# EAGLE design TMPZ84_minimum_BASIC (EAGLE 7.1.0)
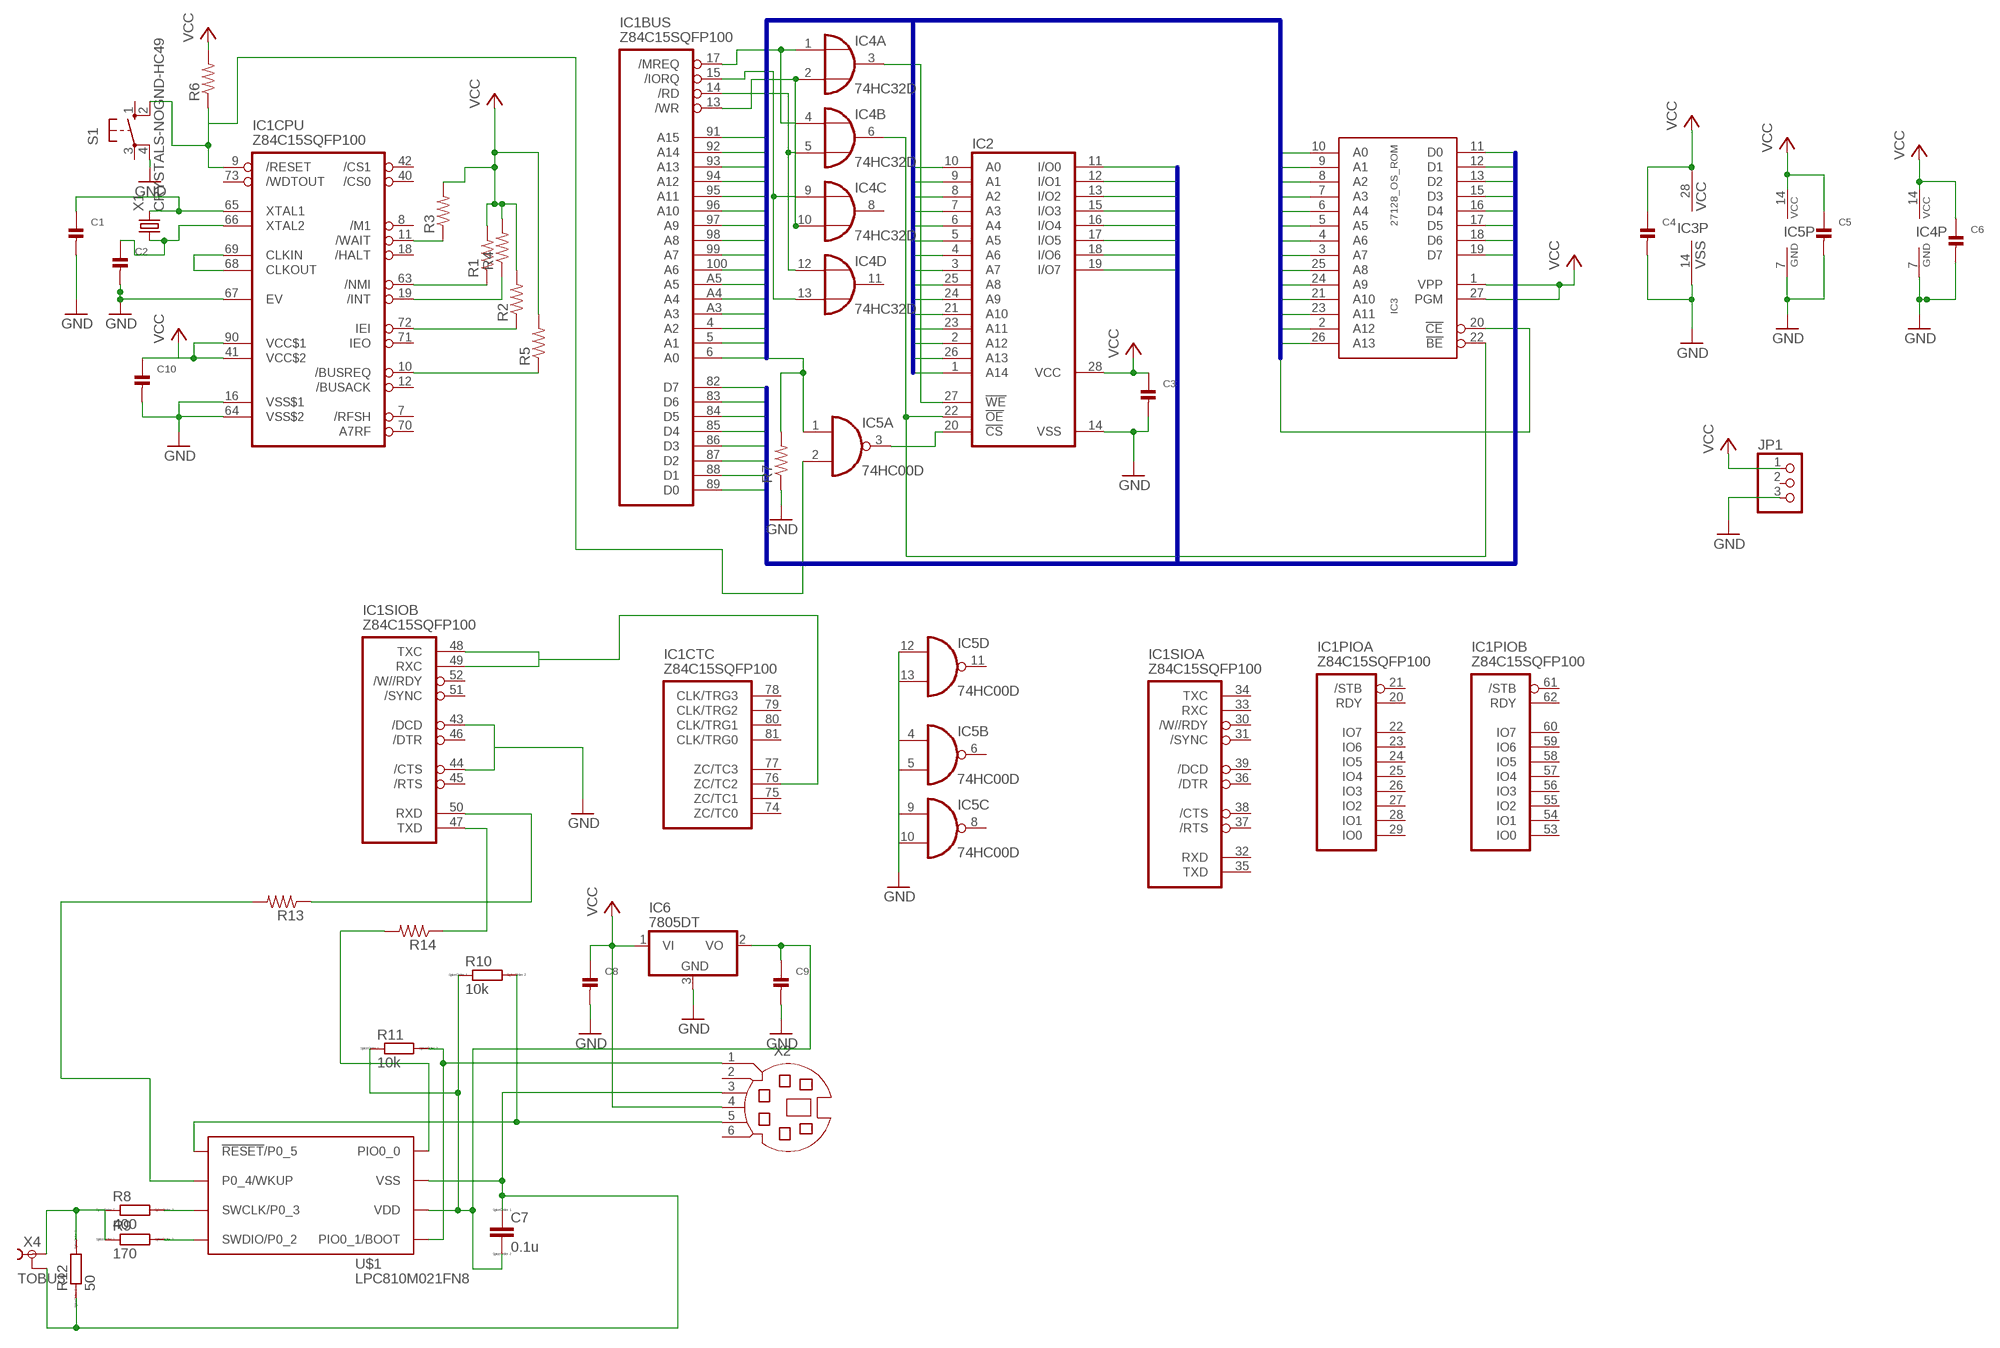
[diagram p0: schematic, sheet 1]

## Parts
C1  CAP_CERAMIC0603  [0603]
C2  CAP_CERAMIC0603  [0603]
C3  CAP_CERAMIC0603  [0603]
C4  CAP_CERAMIC0603  [0603]
C5  CAP_CERAMIC0603  [0603]
C6  CAP_CERAMIC0603  [0603]
C7  0.1u  CC0603  [C0603]
C8  CAP_CERAMIC0603  [0603]
C9  CAP_CERAMIC0603  [0603]
C10  CAP_CERAMIC0603  [0603]
IC1  Z84C15SQFP100  [SQFP-R-14X20-100]
IC2  62256FP  [SO28L]
IC3  27128_OS_ROM  [DIL28]
IC4  74HC32D  [SO14]
IC5  74HC00D  [SO14]
IC6  7805DT  [TO252]
JP1  PINHD-1X3  [1X03]
R1  R-US_R0603  [R0603]
R2  R-US_R0603  [R0603]
R3  R-US_R0603  [R0603]
R4  R-US_R0603  [R0603]
R5  R-US_R0603  [R0603]
R6  R-US_R0603  [R0603]
R7  R-US_R0603  [R0603]
R8  400  RR0603  [R0603]
R9  170  RR0603  [R0603]
R10  10k  RR0603  [R0603]
R11  10k  RR0603  [R0603]
R12  50  RR0603  [R0603]
R13  R-US_R0603  [R0603]
R14  R-US_R0603  [R0603]
S1  10-XX  [B3F-10XX]
U$1  LPC810M021FN8  [DIP8]
X1  CRYSTALS-NOGND-HC49  [HC49]
X2  MD06S  [MDIN06S]
X4  TOBU3  [TOBU3]

## Nets
A0: IC1.6(BUS:A0) IC2.10(A0) IC3.10(A0)
A1: IC1.5(BUS:A1) IC2.9(A1) IC3.9(A1)
A2: IC1.4(BUS:A2) IC2.8(A2) IC3.8(A2)
A3: IC1.A3(BUS:A3) IC2.7(A3) IC3.7(A3)
A4: IC1.A4(BUS:A4) IC2.6(A4) IC3.6(A4)
A5: IC1.A5(BUS:A5) IC2.5(A5) IC3.5(A5)
A6: IC1.100(BUS:A6) IC2.4(A6) IC3.4(A6)
A7: IC1.99(BUS:A7) IC2.3(A7) IC3.3(A7)
A8: IC1.98(BUS:A8) IC2.25(A8) IC3.25(A8)
A9: IC1.97(BUS:A9) IC2.24(A9) IC3.24(A9)
A10: IC1.96(BUS:A10) IC2.21(A10) IC3.21(A10)
A11: IC1.95(BUS:A11) IC2.23(A11) IC3.23(A11)
A12: IC1.93(BUS:A13) IC1.94(BUS:A12) IC2.2(A12) IC3.2(A12)
A13: IC2.26(A13) IC3.26(A13)
A14: IC1.92(BUS:A14) IC2.1(A14)
A15: IC1.91(BUS:A15) IC3.20(!CE) IC5.1(A:I0) R7.2
D0: IC1.89(BUS:D0) IC2.11(I/O0) IC3.11(D0)
D1: IC1.88(BUS:D1) IC2.12(I/O1) IC3.12(D1)
D2: IC1.87(BUS:D2) IC2.13(I/O2) IC3.13(D2)
D3: IC1.86(BUS:D3) IC2.15(I/O3) IC3.15(D3)
D4: IC1.85(BUS:D4) IC2.16(I/O4) IC3.16(D4)
D5: IC1.84(BUS:D5) IC2.17(I/O5) IC3.17(D5)
D6: IC1.83(BUS:D6) IC2.18(I/O6) IC3.18(D6)
D7: IC1.82(BUS:D7) IC2.19(I/O7) IC3.19(D7)
GND: C1.2 C2.2 C3.2 C4.2 C5.2 C6.2 C8.2 C9.2 C10.2 IC1.16(CPU:VSS$1) IC1.43(SIOB:/DCD) IC1.44(SIOB:/CTS) IC1.64(CPU:VSS$2) IC1.67(CPU:EV) IC2.14(VSS) IC3.14(VSS) IC4.7(P:GND) IC5.4(B:I0) IC5.5(B:I1) IC5.7(P:GND) IC5.9(C:I0) IC5.10(C:I1) IC5.12(D:I0) IC5.13(D:I1) IC6.3(GND) JP1.3 R7.1 S1.4(P1)
N$1: C1.1 IC1.65(CPU:XTAL1) X1.2
N$2: C2.1 IC1.66(CPU:XTAL2) X1.1
N$3: IC1.17(BUS:/MREQ) IC4.1(A:I0) IC4.4(B:I0)
N$4: C7.2 C9.1 IC6.2(VO) R10.1 R11.1 U$1.P$6(VDD)
N$5: IC1.13(BUS:/WR) IC4.2(A:I1) IC4.10(C:I1)
N$6: IC1.14(BUS:/RD) IC4.5(B:I1) IC4.12(D:I0)
N$7: IC1.15(BUS:/IORQ) IC4.9(C:I0) IC4.13(D:I1)
N$8: IC2.22(!OE) IC3.22(!BE) IC4.6(B:O)
N$9: IC2.27(!WE) IC4.3(A:O)
N$10: IC1.68(CPU:CLKOUT) IC1.69(CPU:CLKIN)
N$11: IC1.72(CPU:IEI) R2.1
N$12: IC1.63(CPU:/NMI) R1.1
N$13: IC2.20(!CS) IC5.3(A:O)
N$14: IC1.50(SIOB:RXD) R13.1
N$15: IC1.19(CPU:/INT) R4.1
N$16: IC1.11(CPU:/WAIT) R3.1
N$17: IC1.48(SIOB:TXC) IC1.49(SIOB:RXC) IC1.76(CTC:ZC/TC2)
N$18: IC1.10(CPU:/BUSREQ) R5.1
N$19: R11.2 U$1.P$5(PIO0_1/BOOT) X2.1
N$20: IC1.9(CPU:/RESET) IC5.2(A:I1) R6.1 S1.2(S1)
N$21: IC1.47(SIOB:TXD) R14.1
N$22: R10.2 U$1.P$1(!RESET!/P0_5) X2.5
N$23: R8.2 U$1.P$3(SWCLK/P0_3)
N$24: R9.2 U$1.P$4(SWDIO/P0_2)
N$25: R8.1 R9.1 R12.2 X4.1
N$26: C7.1 R12.1 U$1.P$7(VSS) X2.3 X4.2 X4.2@1 X4.2@2
N$27: R13.2 U$1.P$2(P0_4/WKUP)
N$28: R14.2 U$1.P$8(PIO0_0)
VCC: C3.1 C4.1 C5.1 C6.1 C8.1 C10.1 IC1.41(CPU:VCC$2) IC1.90(CPU:VCC$1) IC2.28(VCC) IC3.1(VPP) IC3.27(PGM) IC3.28(VCC) IC4.14(P:VCC) IC5.14(P:VCC) IC6.1(VI) JP1.1 R1.2 R2.2 R3.2 R4.2 R5.2 R6.2 X2.4
Unconnected: IC1.7(CPU:/RFSH) IC1.8(CPU:/M1) IC1.12(CPU:/BUSACK) IC1.18(CPU:/HALT) IC1.20(PIOA:RDY) IC1.21(PIOA:/STB) IC1.22(PIOA:IO7) IC1.23(PIOA:IO6) IC1.24(PIOA:IO5) IC1.25(PIOA:IO4) IC1.26(PIOA:IO3) IC1.27(PIOA:IO2) IC1.28(PIOA:IO1) IC1.29(PIOA:IO0) IC1.30(SIOA:/W//RDY) IC1.31(SIOA:/SYNC) IC1.32(SIOA:RXD) IC1.33(SIOA:RXC) IC1.34(SIOA:TXC) IC1.35(SIOA:TXD) IC1.36(SIOA:/DTR) IC1.37(SIOA:/RTS) IC1.38(SIOA:/CTS) IC1.39(SIOA:/DCD) IC1.40(CPU:/CS0) IC1.42(CPU:/CS1) IC1.45(SIOB:/RTS) IC1.46(SIOB:/DTR) IC1.51(SIOB:/SYNC) IC1.52(SIOB:/W//RDY) IC1.53(PIOB:IO0) IC1.54(PIOB:IO1) IC1.55(PIOB:IO2) IC1.56(PIOB:IO3) IC1.57(PIOB:IO4) IC1.58(PIOB:IO5) IC1.59(PIOB:IO6) IC1.60(PIOB:IO7) IC1.61(PIOB:/STB) IC1.62(PIOB:RDY) IC1.70(CPU:A7RF) IC1.71(CPU:IEO) IC1.73(CPU:/WDTOUT) IC1.74(CTC:ZC/TC0) IC1.75(CTC:ZC/TC1) IC1.77(CTC:ZC/TC3) IC1.78(CTC:CLK/TRG3) IC1.79(CTC:CLK/TRG2) IC1.80(CTC:CLK/TRG1) IC1.81(CTC:CLK/TRG0) IC4.8(C:O) IC4.11(D:O) IC5.6(B:O) IC5.8(C:O) IC5.11(D:O) JP1.2 S1.1(S) S1.3(P) X2.2 X2.6

## Buses
A[0..15]
D[0..7]

## Library data of the parts
C1-C6 C8-C10 = OLED_mod:CAP_CERAMIC: Ceramic Capacitors 0402 - 0402 Surface Mount Capacitors 16pF 50V 5% [Digikey: 445-4899-2-ND] 18pF 50V 5% [Digikey: 490-1281-2-ND] 22pF 50V 5% [Digikey: 490-1283-2-ND] 68pF 50V 5% [Digikey: 490-1289-2-ND] 0.1uF 10V 10% [Digikey: 490-1318-2-ND] 1.0uF 6.3V 10% [Digikey: 490-1320-2-ND] 0603 - 0603 Surface Mount Capacitors 16 pF 50V 5% [Digikey: 445-5051-2-ND] 22 pF 50V [Digikey: PCC220ACVTR-ND] 33 pF 50V 5% [Digikey: 490-1415-1-ND] 56pF 50V 5% [Digikey: 490-1421-1-ND] 220pF 50V 5% [Digikey: 445-1285-1-ND] 680 pF 50V 2200 pF 50V 5% C0G [Digikey: 445-1297-1-ND] 5600 pF 100V 5% X7R [Digikey: 478-3711-1-ND] 0.1 µF 25V 10% [Digikey: PCC2277TR-ND] 0.22 µF 16V 10% X7R [Digikey: 445-1318-1-ND] 1.0 µF 25V 10% [Digikey: 445-5146-2-ND] 0603 - RF Specific 3pF 250V +/-0.1pF RF [Digikey: 712-1347-1-ND] 18 pF 250V 5% [Digikey: 478-3505-1-ND or 712-1322-1-ND] 56 pF 250V 5% C0G RF [Digikey: 490-4867-1-ND] 68 pF 250V RF [Digikey: 490-4868-1-ND] 0805 - 0805 Surface Mount Capacitors 220 pF 250V 2% RF Ceramic Capacitor [Digikey: 712-1398-1-ND] 1000 pF 50V 2% NP0 Ceramic Capacitor [Digikey: 478-3760-1-ND] 0.1 µF 25V 10% Ceramic Capacitor [Digikey: PCC1828TR-ND] 1.0 µF 16V 10% Ceramic Capacitor[Digikey: 490-1691-2-ND] 10.0 µF 10V 10% Ceramic Capacitor[Digikey: 709-1228-1-ND] 10.0 uF 16V 10% Ceramic Capacitor [Digikey: 478-5165-2-ND] 47 uF 6.3V 20% Ceramic Capacitor [Digikey: 587-1779-1-ND or 399-5506-1-ND] 1206 - 1206 Surface Mount Capacitors 47uF 10V 20% Ceramic Capacitor [Digikey: 490-5528-1-ND or 399-5508-1-ND or 445-6010-1-ND] 100uF 6.3V -20%, +80% Y5V Ceramic Capacitor (Digikey: 490-4512-1-ND, Mouser: 81-GRM31CF50J107ZE1L)
C7 = eagle-ltspice:C: CAPACITOR, European symbol; SPICEMODEL: NONE; SPICEPREFIX: C
IC1 = TMPZ84C015_alt2:Z84C15: Zilog Z84C15 in TQFP-100 package IPC Intelligent Peripheral Controller Includes Z80 CPU core, a CTC, 2 PIO and 2 SIO
IC2 = memory-hitachi:62256FP: MEMORY; MPN: CY62256VNLL-70SNXI; OC_FARNELL: 1650073; OC_NEWARK: 19M2582
IC3 = eagle-6.5.0-atari:27128_OS_ROM: 16K x 8 PROM
IC4 = 74xx-eu:74*32: Quad 2-input OR gate
IC5 = 74xx-eu:74*00: Quad 2-input NAND gate
IC6 = linear:78*: Positive VOLTAGE REGULATOR Source: http://cache.national.com/ds/LM/LM78L05.pdf http://www.fairchildsemi.com/ds/LM/LM7805.pdf
JP1 = pinhead:PINHD-1X3: PIN HEADER
R1-R7 R13 R14 = resistor:R-US_: RESISTOR, American symbol
R8-R12 = eagle-ltspice:R: RESISTOR, European symbol; SPICEMODEL: NONE; SPICEPREFIX: R
S1 = switch-omron:10-XX: OMRON SWITCH; MPN: B3F-1000; OC_FARNELL: 176432; OC_NEWARK: 36M3542
U$1 = carrilib:LPC810
X1 = IQD-Frequency-Products:CRYSTALS-NOGND: CRYSTALS CAN NOT GROUNDED
X2 = con-yamaichi:MD06S: YAMAICHI CONNECTOR; OC_FARNELL: unknown; OC_NEWARK: unknown
X4 = con-hirschmann:TOBU3: Female Cinch CONNECTOR ( RCA Jack ); MF: FARNELL; MPN: TOBU 3; OC_FARNELL: 592791; OC_NEWARK: 06WX5914

## Board
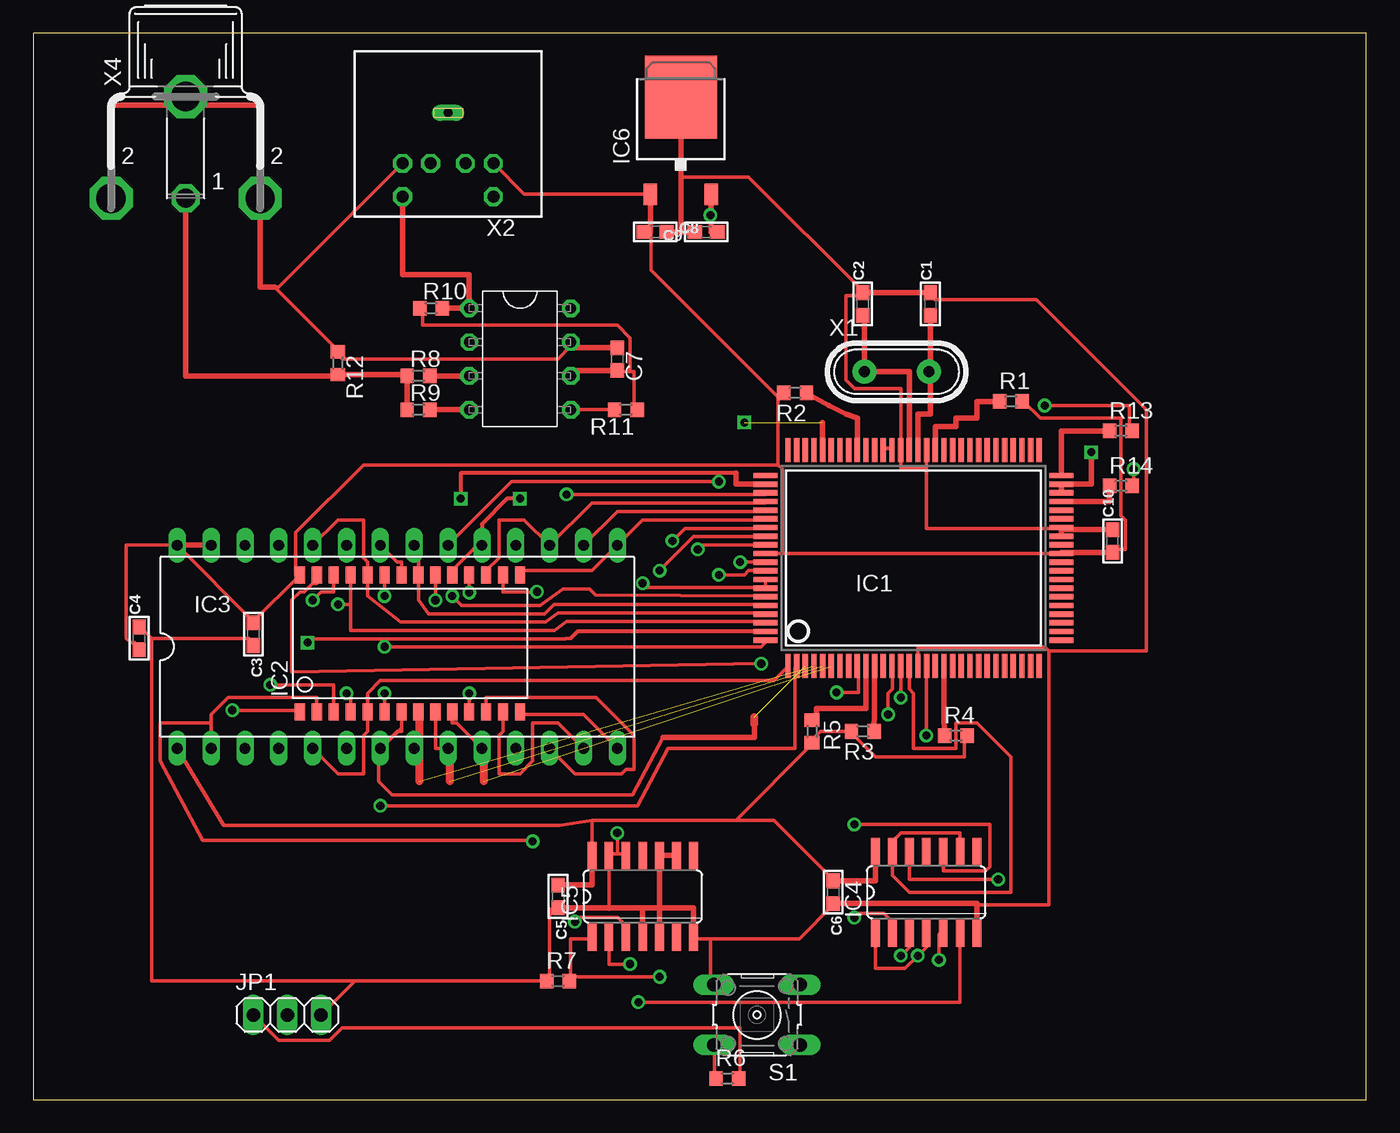
[diagram p1: board, top side]
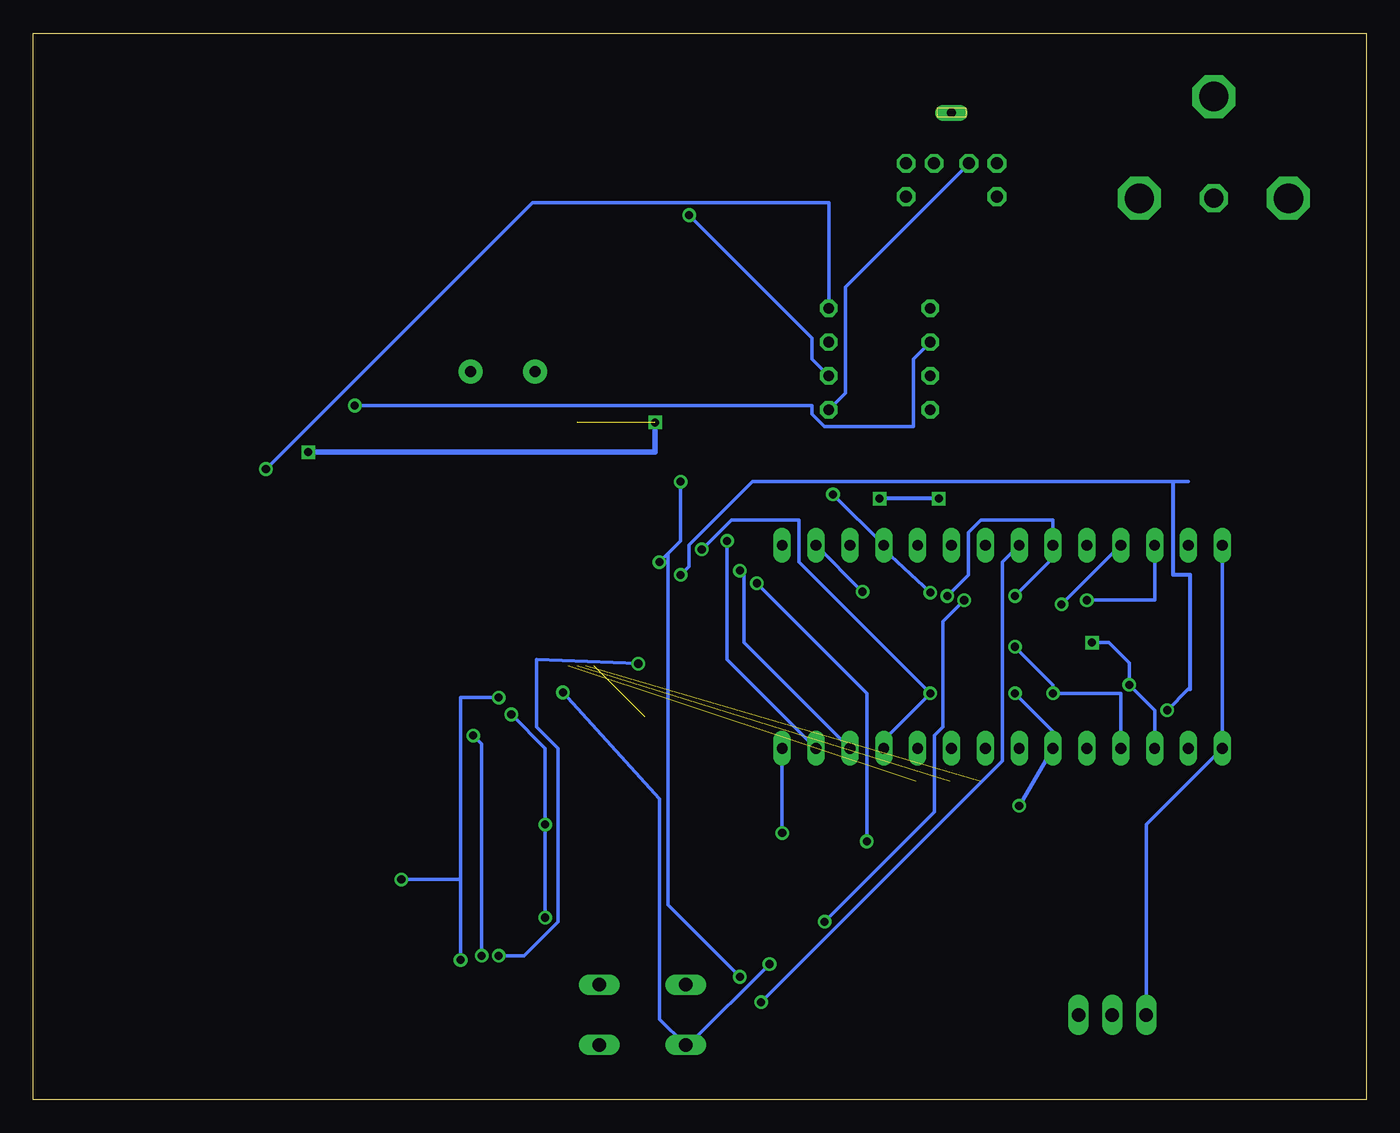
[diagram p2: board, bottom side, seen from below]

Size 100 x 80 mm. Coordinates in mm from the lower left corner, seen from the top.
Outline: 0,0 100,0 100,80 0,80 0,0
Copper layers (1*16): Top 0.035mm / dielectric 1.5mm / Bottom 0.035mm
Design rules "default": minimum track width 10mil, minimum drill 24mil, track to track 8mil, track to pad 8mil, pad to pad 8mil, via to via 8mil, smd to smd 8mil, copper to edge 40mil, drill to drill 8mil, minimum pad ring 10mil, minimum via ring 8mil, stop-mask expansion 4mil, vias tented up to drill 0mil, thermal gap 10mil
vRestrict: area 24.1,66.4 to 38.1,74.9; area 41.3,13.3 to 50.2,17.1; area 62.2,13.7 to 71.8,17.8; area 55.9,33.7 to 76.2,47.9; area 19.5,30 to 37.3,38.6

### Footprints (pad centres in the part's own frame; a part is rotated, then mirrored left to right if it is on the bottom)
0603 = smd 1.1 x 1: 1 -0.85,0; 2 0.85,0
C0603 = smd 1.1 x 1: 1 -0.85,0; 2 0.85,0
SQFP-R-14X20-100 = smd 0.4 x 1.8: 4 -7.475,-8.1; 5 -6.825,-8.1; 6 -6.175,-8.1; 7 -5.525,-8.1; 8 -4.875,-8.1; 9 -4.225,-8.1; 10 -3.575,-8.1; 11 -2.925,-8.1; 12 -2.275,-8.1; 13 -1.625,-8.1; 14 -0.975,-8.1; 15 -0.325,-8.1; 16 0.325,-8.1; 17 0.975,-8.1; 18 1.625,-8.1; 19 2.275,-8.1; 20 2.925,-8.1; 21 3.575,-8.1; 22 4.225,-8.1; 23 4.875,-8.1; 24 5.525,-8.1; 25 6.175,-8.1; 26 6.825,-8.1; 27 7.475,-8.1; 28 8.125,-8.1; 29 8.775,-8.1; 30 9.425,-8.1; 51 9.425,8.1; 52 8.775,8.1; 53 8.125,8.1; 54 7.475,8.1; 55 6.825,8.1; 56 6.175,8.1; 57 5.525,8.1; 58 4.875,8.1; 59 4.225,8.1; 60 3.575,8.1; 61 2.925,8.1; 62 2.275,8.1; 63 1.625,8.1; 64 0.975,8.1; 65 0.325,8.1; 66 -0.325,8.1; 67 -0.975,8.1; 68 -1.625,8.1; 69 -2.275,8.1; 70 -2.925,8.1; 71 -3.575,8.1; 72 -4.225,8.1; 73 -4.875,8.1; 74 -5.525,8.1; 75 -6.175,8.1; 76 -6.825,8.1; 77 -7.475,8.1; 78 -8.125,8.1; 79 -8.775,8.1; 80 -9.425,8.1; A3 -8.125,-8.1; A4 -8.775,-8.1; A5 -9.425,-8.1 | smd 1.8 x 0.4: 31 11.1,-6.175; 32 11.1,-5.525; 33 11.1,-4.875; 34 11.1,-4.225; 35 11.1,-3.575; 36 11.1,-2.925; 37 11.1,-2.275; 38 11.1,-1.625; 39 11.1,-0.975; 40 11.1,-0.325; 41 11.1,0.325; 42 11.1,0.975; 43 11.1,1.625; 44 11.1,2.275; 45 11.1,2.925; 46 11.1,3.575; 47 11.1,4.225; 48 11.1,4.875; 49 11.1,5.525; 50 11.1,6.175; 81 -11.1,6.175; 82 -11.1,5.525; 83 -11.1,4.875; 84 -11.1,4.225; 85 -11.1,3.575; 86 -11.1,2.925; 87 -11.1,2.275; 88 -11.1,1.625; 89 -11.1,0.975; 90 -11.1,0.325; 91 -11.1,-0.325; 92 -11.1,-0.975; 93 -11.1,-1.625; 94 -11.1,-2.275; 95 -11.1,-2.925; 96 -11.1,-3.575; 97 -11.1,-4.225; 98 -11.1,-4.875; 99 -11.1,-5.525; 100 -11.1,-6.175
SO28L = smd 0.762 x 1.27: 1 -7.62,-5.207; 2 -6.35,-5.207; 3 -5.08,-5.207; 4 -3.81,-5.207; 5 -2.54,-5.207; 6 -1.27,-5.207; 7 0,-5.207; 8 1.27,-5.207; 9 2.54,-5.207; 10 3.81,-5.207; 11 5.08,-5.207; 12 6.35,-5.207; 13 7.62,-5.207; 14 8.89,-5.207; 15 8.89,5.08; 16 7.62,5.08; 17 6.35,5.08; 18 5.08,5.08; 19 3.81,5.08; 20 2.54,5.08; 21 1.27,5.08; 22 0,5.08; 23 -1.27,5.08; 24 -2.54,5.08; 25 -3.81,5.08; 26 -5.08,5.08; 27 -6.35,5.08; 28 -7.62,5.08
DIL28 = drill 0.813 long: 1 -16.51,-7.62; 2 -13.97,-7.62; 3 -11.43,-7.62; 4 -8.89,-7.62; 5 -6.35,-7.62; 6 -3.81,-7.62; 7 -1.27,-7.62; 8 1.27,-7.62; 9 3.81,-7.62; 10 6.35,-7.62; 11 8.89,-7.62; 12 11.43,-7.62; 13 13.97,-7.62; 14 16.51,-7.62; 15 16.51,7.62; 16 13.97,7.62; 17 11.43,7.62; 18 8.89,7.62; 19 6.35,7.62; 20 3.81,7.62; 21 1.27,7.62; 22 -1.27,7.62; 23 -3.81,7.62; 24 -6.35,7.62; 25 -8.89,7.62; 26 -11.43,7.62; 27 -13.97,7.62; 28 -16.51,7.62
SO14 = smd 0.66 x 2.032: 1 -3.81,-3.073; 2 -2.54,-3.073; 3 -1.27,-3.073; 4 0,-3.073; 5 1.27,-3.073; 6 2.54,-3.073; 7 3.81,-3.073; 8 3.81,3.073; 9 2.54,3.073; 10 1.27,3.073; 11 0,3.073; 12 -1.27,3.073; 13 -2.54,3.073; 14 -3.81,3.073
TO252 = smd 1 x 1.6: 1 -2.28,-4.8; 2 2.28,-4.8 | smd 5.4 x 6.2: 3 0,2.5
1X03 = drill 1.016 long: 1 -2.54,0; 2 0,0; 3 2.54,0
R0603 = smd 1 x 1.1: 1 -0.85,0; 2 0.85,0
B3F-10XX = drill 1.016 long: 1 -3.251,2.261; 2 3.251,2.261; 3 -3.251,-2.261; 4 3.251,-2.261
DIP8 = drill 0.8 octagon: P$1 -3.81,3.81; P$2 -3.81,1.27; P$3 -3.81,-1.27; P$4 -3.81,-3.81; P$5 3.81,-3.81; P$6 3.81,-1.27; P$7 3.81,1.27; P$8 3.81,3.81
HC49 = drill 0.813 pad 1.8: 1 -2.413,0; 2 2.413,0
MDIN06S = drill 0.9 octagon: 1 1.3,8.5; 2 -1.3,8.5; 3 3.4,8.5; 4 -3.4,8.5; 5 3.4,11; 6 -3.4,11 | drill 0.7 long: M 0,4.7
TOBU3 = drill 1.397 octagon: 1 0,-2.54 | drill 2.21 octagon: 2 5.588,-2.54; 2@1 -5.588,-2.54; 2@2 0,5.08

### Placement (x,y rotation side)
C1  67.31,59.69 90 top
C2  62.23,59.69 90 top
C3  16.51,34.92 270 top
C4  7.94,34.61 90 top
C5  39.37,15.24 270 top
C6  60.01,15.56 270 top
C7  43.81,55.56 270 top
C8  46.67,65.09 0 top
C9  50.48,65.09 180 top
C10  80.96,41.91 90 top
IC1  66.04,40.64 0 top
IC2  27.62,34.29 0 top
IC3  27.3,33.97 0 top
IC4  66.99,15.56 0 top
IC5  45.72,15.24 0 top
IC6  48.58,72.71 0 top
JP1  19.05,6.35 0 top
R1  73.34,52.39 0 top
R2  57.15,53.02 180 top
R3  62.23,27.62 180 top
R4  69.22,27.3 0 top
R5  58.42,27.62 270 top
R6  52.07,1.59 0 top
R7  39.37,8.89 0 top
R8  28.89,54.29 0 top
R9  28.89,51.75 0 top
R10  29.84,59.37 0 top
R11  44.45,51.75 180 top
R12  22.86,55.24 270 top
R13  81.6,50.16 0 top
R14  81.6,46.04 0 top
S1  54.29,6.35 180 top
U$1  36.51,55.56 0 top
X1  64.77,54.61 0 top
X2  31.11,78.74 180 top
X4  11.43,70.17 0 top

### Tracks (layer width: path | path; a pad name or v marks a point on that pad's centre or on a via)
A0  (1 unrouted)
  Top 0.254: IC2.10 31.43,28.26 31.75,28.26 IC3.10
  Top 0.61: IC3.10 33.78,26.35 33.78,23.88
A1  (1 unrouted)
  Top 0.254: IC2.9 30.16,26.35 IC3.9
  Top 0.61: IC3.9 31.24,26.35 31.24,23.88
A2  (1 unrouted)
  Top 0.254: IC2.8 28.89,26.35 IC3.8
  Top 0.61: IC2.8 28.96,29.08 28.96,23.88
A3  (1 unrouted)
  Top 0.254: IC3.7 27.3,27.62 27.62,27.62 IC2.7 27.62,27.88 25.91,26.16 25.91,23.88 26.92,22.86 44.96,22.86 47.24,27.18
  Top 0.406: 47.24,27.18 54.1,27.18 54.1,28.19
  Top 0.61: 54.1,28.19 54.1,28.7
A4  (via drill 0.61)
  Top 0.254: v26.35,30.48 IC2.6 | v26.04,22.04 45.34,22.04 47.62,26.35 57.15,26.35 57.15,32.38 IC1.A4
  Bottom 0.254: v26.35,30.48 23.5,27.62 IC3.6 v26.04,22.04
A5
  Top 0.254: IC3.5 22.86,24.45 24.77,24.45 24.77,27.3 25.08,27.62 IC2.5 25.08,30.48 26.04,31.43 55.56,31.43 56.52,32.38 IC1.A5
A6  (via drill 0.61)
  Top 0.254: IC2.4 23.81,30.48 v23.5,30.48 | v26.35,33.97 54.61,33.97 54.93,34.29 IC1.100
  Bottom 0.254: IC3.4 18.41,30.48 v23.5,30.48 23.5,31.11 v26.35,33.97
A7  (via drill 0.6, 0.61)
  Top 0.254: IC2.3 22.54,31.11 v17.78,31.11 | 40.32,34.61 39.94,34.61 39.88,34.54 20.83,34.54 v20.57,34.29
  Top 0.305: IC1.99 40.83,35.12 40.32,34.61
  Bottom 0.254: IC3.3 15.88,29.21 v17.78,31.11 17.78,32.77 19.3,34.29 v20.57,34.29
A8  (via drill 0.61)
  Top 0.254: 23.81,37.15 23.81,35.18 39.12,35.18 40.01,35.88 54.93,35.88 IC1.98 | 23.81,37.15 IC2.25 | 23.81,37.15 v22.86,37.15
  Bottom 0.254: v22.86,37.15 IC3.25
A9
  Top 0.254: IC3.24 22.86,43.5 24.77,43.5 24.77,40.64 25.08,40.32 IC2.24 25.08,37.78 27.56,35.81 38.42,35.81 39.37,36.51 54.93,36.51 IC1.97
A10
  Top 0.254: IC3.21 28.89,41.59 IC2.21 28.89,37.47 29.65,36.45 38.35,36.45 39.05,37.15 54.93,37.15 IC1.96
A11  (via drill 0.61)
  Top 0.254: v26.35,37.78 IC2.23 | v31.43,37.78 32.13,37.08 38.04,37.08 39.75,38.29 41.72,38.29 42.16,37.85 54.93,37.78 IC1.95
  Bottom 0.254: v26.35,37.78 23.5,40.64 IC3.23 23.5,43.5 28.89,43.5 29.84,42.55 29.84,39.37 v31.43,37.78
A12  (via drill 0.61)
  Top 0.254: 54.93,38.42 54.93,39.05 IC1.93 | IC2.2 21.27,30.16 14.61,30.16 13.34,28.89 13.34,28.26 | IC3.2 13.34,28.26 | 54.93,38.42 46.04,38.42 v45.72,38.73 | v37.47,19.37 37.4,19.43 12.7,19.43 9.53,25.4 9.53,28.26 13.34,28.26 | 54.93,38.42 IC1.94
  Bottom 0.254: v45.72,38.73 37.47,30.48 v37.47,19.37
A13  (via drill 0.61)
  Top 0.254: IC2.26 22.54,38.1 21.59,38.1 v20.95,37.47
  Bottom 0.254: v20.95,37.47 15.88,37.47 IC3.26
A14  (via drill 0.61)
  Top 0.254: v14.92,29.21 20,29.21 IC2.1 | v51.44,39.37 53.34,39.37 53.66,39.69 54.93,39.69 IC1.92
  Bottom 0.254: 13.34,30.8 v14.92,29.21 | v51.44,39.37 50.8,40.01 50.8,41.59 46.04,46.35 14.48,46.35 13.34,46.35
  Bottom 0.305: 13.34,30.8 13.21,30.8 13.21,39.37 14.48,39.37 14.48,46.35
A15  (via drill 0.61)
  Top 0.254: 40.32,9.21 40.32,12.06 41.91,12.06 IC5.1 | 40.32,9.21 40.32,8.89 R7.2 40.32,9.21 | v53.02,40.32 54.93,40.32 IC1.91 | v51.44,46.35 35.88,46.35 IC3.20 | v46.99,9.21 40.32,9.21
  Bottom 0.254: 52.39,40.96 51.44,41.91 v51.44,46.35 | 52.39,40.96 v53.02,40.32 | v46.99,9.21 52.39,14.61 52.39,40.96
D0  (via drill 0.61)
  Top 0.254: v32.7,30.48 IC2.11 | v49.85,41.27 50.16,41.59 54.93,41.59 IC1.89
  Bottom 0.254: IC3.11 36.2,26.99 v32.7,30.48 42.55,40.32 42.55,43.5 47.62,43.5 v49.85,41.27
D1  (via drill 0.61)
  Top 0.254: IC2.12 33.97,30.16 42.23,30.16 45.09,27.3 45.09,24.77 44.45,24.77 44.13,24.45 40.64,24.45 IC3.12 | v46.99,39.69 49.53,42.23 54.93,42.23 IC1.88
  Bottom 0.254: v46.99,39.69 46.67,39.37 46.67,34.29 IC3.12
D2  (via drill 0.61)
  Top 0.254: IC2.13 35.24,27.62 34.92,27.3 34.92,24.45 36.51,24.45 37.47,25.4 37.47,28.26 39.37,28.26 IC3.13 | v47.94,41.91 48.9,42.86 54.93,42.86 IC1.87
  Bottom 0.254: v47.94,41.91 47.94,33.02 IC3.13
D3
  Top 0.254: IC2.15 36.83,39.69 41.91,39.69 IC3.15 45.72,43.5 54.93,43.5 IC1.86
D4  (via drill 0.61)
  Top 0.254: IC2.16 35.24,38.1 v37.78,38.1 | IC3.16 43.81,44.13 54.93,44.13 IC1.85
  Bottom 0.254: IC3.16 v37.78,38.1
D5
  Top 0.254: IC2.17 33.97,39.69 34.92,40.64 34.92,43.5 36.83,43.5 IC3.17 41.91,44.77 54.93,44.77 IC1.84
D6  (via drill 0.61)
  Top 0.254: v32.7,38.04 IC2.18 | v40.01,45.4 54.93,45.4 IC1.83
  Bottom 0.254: v32.7,38.04 36.2,41.27 IC3.18 v40.01,45.4
D7  (via drill 0.6)
  Top 0.254: IC2.19 31.43,39.69 33.34,41.59 IC3.19
  Top 0.305: 52.7,46.99 32.07,46.99 v32.07,45.09 | v36.51,45.09 35.56,45.09 33.66,43.18 IC3.19
  Top 0.406: IC1.82 52.7,46.16 52.7,46.99
  Bottom 0.305: v32.07,45.09 v36.51,45.09
GND  (via drill 0.61)
  Top 0.254: 66.99,47.62 66.67,47.31 65.09,47.31 65.09,48.58 IC1.67 65.09,48.9 65.09,53.34 61.59,53.34 60.96,53.98 60.96,60.33 62.23,60.33 C2.2 62.23,60.64 53.66,69.22 48.58,69.22 | 66.99,47.62 66.99,48.58 IC1.64 | 66.99,47.62 66.99,42.86 76.83,42.86 IC1.44 | 76.2,33.66 75.88,33.97 66.36,33.97 66.36,32.7 IC1.16 | 76.2,33.66 76.2,14.61 70.8,14.61 | IC3.14 41.27,28.89 36.51,28.89 IC2.14 | 8.89,34.61 16.19,34.61 16.51,34.29 C3.2 | 8.89,34.61 8.26,35.24 7.94,35.24 C4.2 | 43.81,18.41 44.45,18.41 IC5.12 | 43.81,18.41 43.18,18.41 IC5.13 43.18,14.39 43.18,14.29 | C5.2 39.37,14.29 38.73,14.29 38.73,8.89 R7.1 24.13,8.89 | 24.13,8.89 JP1.3 | 50.8,12.06 50.8,8.89 S1.4 | 50.8,12.06 49.53,12.06 IC5.7 | 8.89,34.61 8.89,8.89 24.13,8.89 | 43.81,18.41 v43.81,20 | 50.8,12.06 57.47,12.06 60.01,14.61 C6.2 | 76.2,33.66 83.5,33.66 83.5,51.75 75.25,60.01 67.63,60.01 67.31,60.33 C1.2
  Top 0.406: C10.2 77.14,42.76 | 77.14,42.76 IC1.44 | 77.14,42.76 IC1.43 | C5.2 43.18,14.39 45.72,14.39 | 46.99,14.39 IC5.5 | 46.99,14.39 45.72,14.39 | 45.72,14.39 IC5.4 | 46.99,14.39 49.53,14.39 IC5.7 | 46.99,14.39 IC5.10 IC5.9 | C6.2 70.8,14.71 70.8,14.61 IC4.7 | C2.2 C1.2 | C8.2 C9.2 48.58,65.09 48.58,69.22 IC6.3
  Bottom 0.254: v43.81,20 IC3.14
N$1
  Top 0.406: 67.31,54.61 67.31,51.44 66.36,51.44 IC1.65 | X1.2 67.31,54.61 | 67.31,54.61 C1.1
N$2
  Top 0.406: C2.1 62.23,59.05 62.36,59.05 X1.1 65.72,54.61 IC1.66
N$3  (via drill 0.61)
  Top 0.254: v66.99,27.3 66.99,32.38 IC1.17 | IC4.4 66.99,11.43 v66.36,10.79 65.41,9.84 63.18,9.84 IC4.1
  Bottom 0.254: v66.99,27.3 66.36,26.67 v66.36,10.79
N$4  (via drill 0.61)
  Top 0.254: 44.77,54.61 43.81,54.61 C7.2 | 44.77,54.61 45.09,54.61 45.09,51.75 R11.1 | 44.77,54.61 44.77,57.15 43.81,58.1 29.21,58.1 29.21,59.37 R10.1 | v50.8,66.36 50.86,66.36
  Top 0.406: C7.2 40.32,54.71 U$1.P$6 | C9.1 50.86,65.09 50.86,66.36 IC6.2
  Bottom 0.254: v50.8,66.36 41.59,57.15 41.59,55.56 U$1.P$6
N$5  (via drill 0.61)
  Top 0.254: v64.14,28.89 64.14,30.48 64.45,30.8 64.45,32.38 IC1.13 | v61.59,13.65 61.91,13.97 63.82,13.97 64.45,13.34 IC4.2 | IC4.10 68.26,17.14 71.44,17.14 71.75,17.46 71.75,20.64 v61.59,20.64
  Bottom 0.254: v64.14,28.89 61.59,26.35 v61.59,20.64 v61.59,13.65
N$6  (via drill 0.61)
  Top 0.254: v65.09,30.16 65.09,32.38 IC1.14 | v67.94,10.48 67.94,12.38 68.26,12.38 IC4.5 | IC4.12 65.72,16.51 v72.39,16.51
  Bottom 0.254: v65.09,30.16 67.94,30.16 67.94,16.51 | v67.94,10.48 67.94,16.51 | 67.94,16.51 v72.39,16.51
N$7
  Top 0.254: IC1.15 65.72,32.38 65.72,30.8 66.04,30.48 66.04,26.35 69.22,26.35 69.22,28.26 70.8,28.26 73.34,25.72 73.34,15.56 65.72,15.56 64.45,16.83 IC4.13 64.45,19.37 65.09,20 69.53,20 IC4.9
N$8  (via drill 0.61)
  Top 0.254: IC2.22 27.62,40.32 27.3,40.32 IC3.22 | IC4.6 69.53,7.3 v45.4,7.3
  Bottom 0.254: v45.4,7.3 27.3,25.4 27.3,40.32 IC3.22
N$9  (via drill 0.61)
  Top 0.254: IC2.27 21.27,38.73 20.95,38.73 20.32,38.1 20,38.1 19.37,37.47 19.37,32.07 v54.61,32.7 | v65.09,10.79 65.72,11.43 IC4.3
  Bottom 0.254: v54.61,32.7 62.23,33.02 62.23,27.94 60.64,26.35 60.64,13.34 63.18,10.79 v65.09,10.79
N$10
  Top 0.254: 63.82,48.9 IC1.69 | 64.45,48.9 IC1.68
  Top 0.305: 63.82,48.9 64.42,48.9 IC1.68
N$11
  Top 0.406: R2.1 59.69,52.07 60.96,51.44 61.81,51.12 IC1.72
N$12
  Top 0.406: R1.1 70.8,52.39 70.8,51.12 69.22,51.12 69.22,50.48 67.67,50.48 IC1.63
N$13  (via drill 0.61)
  Top 0.254: v30.16,37.47 IC2.20 | v40.64,13.34 40.96,13.65 43.81,13.65 44.45,13.02 IC5.3
  Bottom 0.254: v30.16,37.47 31.75,35.88 31.75,27.94 32.38,27.3 32.38,21.59 v40.64,13.34
N$14
  Top 0.406: R13.1 77.14,50.16 IC1.50
N$15
  Top 0.406: R4.1 68.31,28.89 IC1.19
N$16
  Top 0.406: R3.1 63.12,29.21 IC1.11
N$17  (via drill 0.6)  (1 unrouted)
  Top 0.406: IC1.48 IC1.49 79.38,46.16 v79.38,48.58 | 59.22,50.8 IC1.76
  Bottom 0.406: v79.38,48.58 53.34,48.58 v53.34,50.8
N$18
  Top 0.406: R5.1 58.74,28.47 58.74,29.34 62.47,29.34 IC1.10
N$19
  Top 0.254: U$1.P$5 R11.2
  Bottom 0.254: U$1.P$5 39.05,53.02 39.05,60.96 29.84,70.17 X2.1
N$20  (via drill 0.61)
  Top 0.254: R6.1 51.12,1.59 51.12,3.81 S1.2 | v60.26,30.54 61.91,30.54 61.91,32.38 IC1.9 | IC5.2 43.18,10.16 v44.77,10.16
  Bottom 0.254: v60.26,30.54 53.02,22.54 53.02,6.03 51.12,4.13 S1.2 50.8,4.13 v44.77,10.16
N$21
  Top 0.406: IC1.47 80.75,44.87 R14.1
N$22
  Top 0.406: R10.2 U$1.P$1 32.7,61.91 27.71,61.91 X2.5
N$23
  Top 0.406: U$1.P$3 R8.2
N$24
  Top 0.406: U$1.P$4 R9.2
N$25
  Top 0.406: R9.1 R8.1 28.04,54.4 R12.2 22.86,54.29 11.43,54.29 X4.1
N$26
  Top 0.254: X2.3 27.62,70.17 18.41,60.96 18.1,60.96 22.86,56.2 R12.1 22.86,55.88 23.18,55.56 39.37,55.56 40.32,56.52
  Top 0.406: C7.1 40.32,56.41 40.32,56.52 U$1.P$7 | 18.1,60.96 17.02,60.96 X4.2 17.14,67.63 17.14,74.61 11.43,74.61 | X4.2@1 5.84,74.61 11.43,74.61 | 11.43,74.61 X4.2@2
N$27  (via drill 0.61)
  Top 0.254: v75.88,52.07 82.23,52.07 82.23,50.16 R13.2
  Bottom 0.254: v75.88,52.07 41.59,52.07 41.59,51.44 40.64,50.48 33.97,50.48 33.97,55.56 U$1.P$2
N$28  (via drill 0.61)
  Top 0.254: v82.55,47.31 82.55,46.04 R14.2
  Bottom 0.254: v82.55,47.31 62.55,67.31 40.32,67.31 U$1.P$8
VCC
  Top 0.254: R1.2 74.3,52.39 75.56,51.12 81.6,51.12 81.6,43.81 81.92,43.5 81.92,41.27 80.96,41.27 C10.1 | 56.2,40.96 76.83,40.96 IC1.41 | 56.2,40.96 55.24,40.96 IC1.90 | 55.88,52.7 46.35,62.23 46.35,65.09 C8.1 | 55.88,52.7 56.2,52.7 R2.2 | X2.4 34.61,70.17 36.83,67.94 46.04,67.94 IC6.1 | 56.2,40.96 56.2,47.31 55.88,47.62 | 55.88,52.7 55.88,47.62 | 61.28,27.62 59.05,27.62 58.42,26.99 R5.2 58.42,26.67 52.7,20.95 | 61.28,27.62 63.18,25.72 69.85,25.72 69.85,27.3 R4.2 | 61.28,27.62 R3.2 | 41.91,20.95 IC5.14 | 52.7,20.95 55.56,20.95 60.01,16.51 C6.1 | 52.7,20.95 41.91,20.95 | 16.51,35.88 IC2.28 19.68,39.37 19.68,42.55 24.77,47.62 55.88,47.62 | C4.1 7.94,33.97 7.62,34.29 7.3,34.29 6.99,34.61 6.99,41.59 IC3.28 16.51,35.88 | 16.51,35.88 C3.1 | JP1.1 18.41,4.45 22.23,4.45 23.18,5.4 53.02,5.4 53.02,1.59 R6.2 | 41.91,20.95 39.5,20.57 14.29,20.57 IC3.1
  Top 0.406: C10.1 77.14,41.06 IC1.41 | C5.1 41.91,16.09 IC5.14 | C6.1 63.18,16.41 IC4.14 | C8.1 46.3,65.09 IC6.1 | IC3.28 IC3.27
  Bottom 0.254: IC3.28 IC3.1 16.51,20.64 JP1.1